# Altium project HLib-MBoard1.PrjPCB
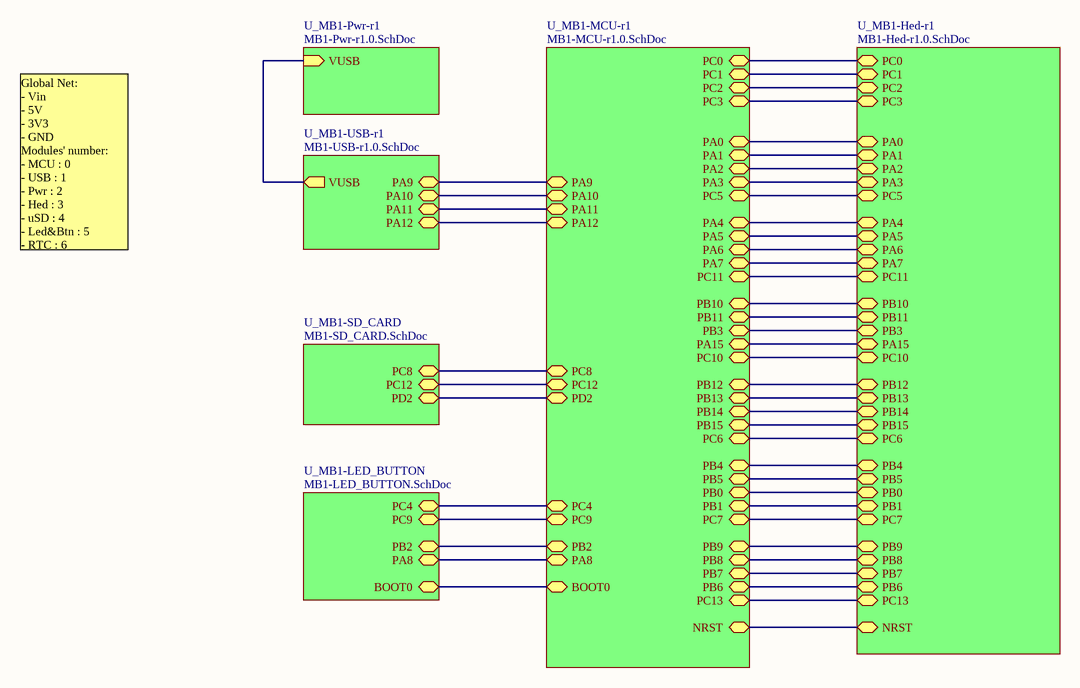
[diagram p0: MBoard1-R1.0.SchDoc]
7 sheets, 130 parts. Net scope: hierarchical (ports join the sheet entries above them; power ports are global).
Board file: HLib-MBoard1.PcbDoc
Sheets:
  MBoard1-R1.0.SchDoc
    U_MB1-Pwr-r1 = MB1-Pwr-r1.0.SchDoc
    U_MB1-USB-r1 = MB1-USB-r1.0.SchDoc
    U_MB1-Hed-r1 = MB1-Hed-r1.0.SchDoc
    U_MB1-MCU-r1 = MB1-MCU-r1.0.SchDoc
    U_MB1-SD_CARD = MB1-SD_CARD.SchDoc
    U_MB1-LED_BUTTON = MB1-LED_BUTTON.SchDoc

## Sheet MBoard1-R1.0.SchDoc: HLib - MBoard1
size A; DrawnBy: MBoard team; DocumentNumber: 1; Revision: 1.1; SheetNumber: 1; SheetTotal: 7; ProjectName: HLib

### Sub-sheets
U_MB1-Hed-r1 = MB1-Hed-r1.0.SchDoc: PC0 (bidir), PC1 (bidir), PC2 (bidir), PC3 (bidir), PA0 (bidir), PA1 (bidir), PA2 (bidir), PA3 (bidir), PA4 (bidir), PA5 (bidir), PA6 (bidir), PA7 (bidir), PB10 (bidir), PB11 (bidir), PB3 (bidir), PA15 (bidir), PB12 (bidir), PB13 (bidir), PB14 (bidir), PB15 (bidir), PB4 (bidir), PB5 (bidir), PB0 (bidir), PB1 (bidir), PB9 (bidir), PB8 (bidir), PB6 (bidir), PB7 (bidir), NRST (bidir), PC6 (bidir), PC10 (bidir), PC5, PC11, PC7 (bidir), PC13 (bidir)
U_MB1-LED_BUTTON = MB1-LED_BUTTON.SchDoc: PC4 (bidir), PB2 (bidir), PA8 (bidir), BOOT0 (bidir), PC9 (bidir)
U_MB1-MCU-r1 = MB1-MCU-r1.0.SchDoc: PA0 (bidir), PA1 (bidir), PA2 (bidir), PA3 (bidir), PA4 (bidir), PA5 (bidir), PA6 (bidir), PA7 (bidir), PA8 (bidir), PA9 (bidir), PA10 (bidir), PA11 (bidir), PA12 (bidir), PA15 (bidir), PD2 (bidir), BOOT0 (bidir), NRST (bidir), PB0 (bidir), PB1 (bidir), PB2 (bidir), PB3 (bidir), PB4 (bidir), PB5 (bidir), PB6 (bidir), PB7 (bidir), PB8 (bidir), PB9 (bidir), PB10 (bidir), PB11 (bidir), PB12 (bidir), PB13 (bidir), PB14 (bidir), PB15 (bidir), PC0 (bidir), PC1 (bidir), PC2 (bidir), PC3 (bidir), PC4 (bidir), PC5 (bidir), PC6 (bidir), PC7 (bidir), PC8 (bidir), PC9 (bidir), PC10 (bidir), PC11 (bidir), PC12 (bidir), PC13 (bidir)
U_MB1-Pwr-r1 = MB1-Pwr-r1.0.SchDoc: VUSB (in)
U_MB1-SD_CARD = MB1-SD_CARD.SchDoc: PD2 (bidir), PC12 (bidir), PC8 (bidir)
U_MB1-USB-r1 = MB1-USB-r1.0.SchDoc: PA9 (bidir), PA10 (bidir), VUSB (out), PA11 (bidir), PA12 (bidir)

### Nets
Ain0: sheet U_MB1-Hed-r1/PC0, sheet U_MB1-MCU-r1/PC0
Ain1: sheet U_MB1-Hed-r1/PC1, sheet U_MB1-MCU-r1/PC1
Ain2: sheet U_MB1-Hed-r1/PC2, sheet U_MB1-MCU-r1/PC2
Ain3: sheet U_MB1-Hed-r1/PC3, sheet U_MB1-MCU-r1/PC3
BOOT0: sheet U_MB1-MCU-r1/BOOT0, sheet U_MB1-LED_BUTTON/BOOT0
BOOT1: sheet U_MB1-MCU-r1/PB2, sheet U_MB1-LED_BUTTON/PB2
CAN_Rx/I2C1_SCK/TM4_CH3: sheet U_MB1-Hed-r1/PB8, sheet U_MB1-MCU-r1/PB8
CAN_Tx/I2C1_SDA/TM4_CH4: sheet U_MB1-Hed-r1/PB9, sheet U_MB1-MCU-r1/PB9
ClockOut: sheet U_MB1-MCU-r1/PA8, sheet U_MB1-LED_BUTTON/PA8
D11_N: sheet U_MB1-USB-r1/PA11, sheet U_MB1-MCU-r1/PA11
D11_P: sheet U_MB1-USB-r1/PA12, sheet U_MB1-MCU-r1/PA12
DATALINE_BIT0: sheet U_MB1-MCU-r1/PC8, sheet U_MB1-SD_CARD/PC8
DebugGreen: sheet U_MB1-MCU-r1/PC4, sheet U_MB1-LED_BUTTON/PC4
DebugRed: sheet U_MB1-MCU-r1/PC9, sheet U_MB1-LED_BUTTON/PC9
I2S_MCLK: sheet U_MB1-Hed-r1/PC6, sheet U_MB1-MCU-r1/PC6
IO1 (ADC): sheet U_MB1-Hed-r1/PC5, sheet U_MB1-MCU-r1/PC5
IO1 (Anti-Tamper): sheet U_MB1-Hed-r1/PC13, sheet U_MB1-MCU-r1/PC13
IO1 (P3): sheet U_MB1-Hed-r1/PC11, sheet U_MB1-MCU-r1/PC11
IO1 (P6): sheet U_MB1-Hed-r1/PC7, sheet U_MB1-MCU-r1/PC7
IO1/TM2_CH2: sheet U_MB1-Hed-r1/PB3, sheet U_MB1-MCU-r1/PB3
IO2/TM2_CH1: sheet U_MB1-Hed-r1/PA15, sheet U_MB1-MCU-r1/PA15
IO3 (P5): sheet U_MB1-Hed-r1/PC10, sheet U_MB1-MCU-r1/PC10
NRST: sheet U_MB1-Hed-r1/NRST, sheet U_MB1-MCU-r1/NRST
RxD: sheet U_MB1-USB-r1/PA9, sheet U_MB1-MCU-r1/PA9
SPI1_MISO: sheet U_MB1-Hed-r1/PA6, sheet U_MB1-MCU-r1/PA6
SPI1_MOSI: sheet U_MB1-Hed-r1/PA7, sheet U_MB1-MCU-r1/PA7
SPI1_NSS/DAC_OUT1: sheet U_MB1-Hed-r1/PA4, sheet U_MB1-MCU-r1/PA4
SPI1_SCK/DAC_OUT2: sheet U_MB1-Hed-r1/PA5, sheet U_MB1-MCU-r1/PA5
SPI2_MISO: sheet U_MB1-Hed-r1/PB14, sheet U_MB1-MCU-r1/PB14
SPI2_MOSI/I2S2_SD: sheet U_MB1-Hed-r1/PB15, sheet U_MB1-MCU-r1/PB15
SPI2_NSS/I2S2_WS: sheet U_MB1-Hed-r1/PB12, sheet U_MB1-MCU-r1/PB12
SPI2_SCK/I2S2_CK: sheet U_MB1-Hed-r1/PB13, sheet U_MB1-MCU-r1/PB13
TM3_CH1: sheet U_MB1-Hed-r1/PB4, sheet U_MB1-MCU-r1/PB4
TM3_CH2: sheet U_MB1-Hed-r1/PB5, sheet U_MB1-MCU-r1/PB5
TM3_CH3: sheet U_MB1-Hed-r1/PB0, sheet U_MB1-MCU-r1/PB0
TM3_CH4: sheet U_MB1-Hed-r1/PB1, sheet U_MB1-MCU-r1/PB1
TM4_CH1: sheet U_MB1-Hed-r1/PB6, sheet U_MB1-MCU-r1/PB6
TM4_CH2: sheet U_MB1-Hed-r1/PB7, sheet U_MB1-MCU-r1/PB7
TxD: sheet U_MB1-USB-r1/PA10, sheet U_MB1-MCU-r1/PA10
US2_CTS/TM5_CH4: sheet U_MB1-Hed-r1/PA0, sheet U_MB1-MCU-r1/PA0
US2_RTS/TM5_CH3: sheet U_MB1-Hed-r1/PA1, sheet U_MB1-MCU-r1/PA1
US2_Rx/TM5_CH1: sheet U_MB1-Hed-r1/PA3, sheet U_MB1-MCU-r1/PA3
US2_Tx/TM5_CH2: sheet U_MB1-Hed-r1/PA2, sheet U_MB1-MCU-r1/PA2
US3_Rx/I2C2_SDA/TM2_CH4: sheet U_MB1-Hed-r1/PB11, sheet U_MB1-MCU-r1/PB11
US3_Tx/I2C2_SCL/TM2_CH3: sheet U_MB1-Hed-r1/PB10, sheet U_MB1-MCU-r1/PB10
uSD_CLK: sheet U_MB1-MCU-r1/PC12, sheet U_MB1-SD_CARD/PC12
uSD_CMD: sheet U_MB1-MCU-r1/PD2, sheet U_MB1-SD_CARD/PD2
VUSB0: sheet U_MB1-Pwr-r1/VUSB, sheet U_MB1-USB-r1/VUSB

### Notes on the sheet
- Global Net:
  - Vin
  - 5V
  - 3V3
  - GND
  Modules' number:
  - MCU : 0
  - USB : 1
  - Pwr : 2
  - Hed : 3
  - uSD : 4
  - Led&Btn : 5
  - RTC : 6

## Sheet MB1-Pwr-r1.0.SchDoc: Power
size A; DrawnBy: MBoard team; DocumentNumber: 4; Revision: 1.1; SheetNumber: 4; SheetTotal: 7
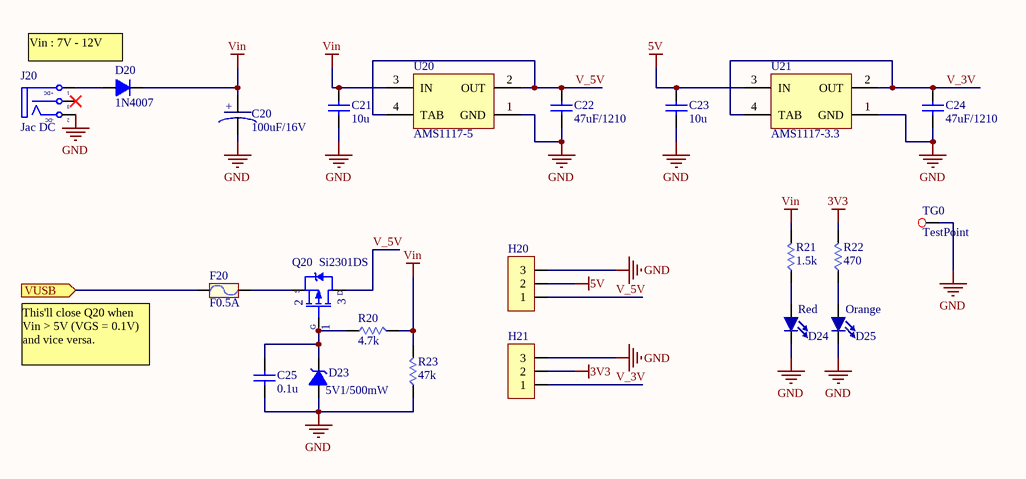
[diagram p1: MB1-Pwr-r1.0.SchDoc]

### Parts
C20  value 100uF/16V  [TantalumCaseD]  (hidden comment: CapT)
C21  value 10u  [SM_0805_LD]  (hidden comment: CAP Ceramic)
C22  value 47uF/1210  [SM-1210]  (hidden comment: CAP Ceramic)
C23  value 10u  [SM_0805_LD]  (hidden comment: CAP Ceramic)
C24  value 47uF/1210  [SM-1210]  (hidden comment: CAP Ceramic)
C25  value 0.1u  [SM_0805_LD]  (hidden comment: CAP Ceramic)
D20  1N4007  [DO-214AC]
D23  5V1/500mW  [SOD-123]
D24  Red  [SM_0805_POL_LD]
D25  Orange  [SM_0805_POL_LD]
F20  F0.5A  [SMD-1812]
H20  Hed3  [Hed3]  (value not drawn)
H21  Hed3  [Hed3]  (value not drawn)
J20  Jac DC  [DCJack]
Q20  Si2301DS  [SOT23]
R20  value 4.7k  [SM_0805_LD]
R21  value 1.5k  [SM_0805_LD]
R22  value 470  [SM_0805_LD]
R23  value 47k  [SM_0805_LD]
TG0  TestPoint  [TestPoint]
U20  AMS1117-5  [MP04A_N]
U21  AMS1117-3.3  [MP04A_N]

### Ports
VUSB (in)

### Nets
3V3: H21.2 R22.2
5V: C23.2 H20.2 U21.3(IN)
GND: C20.2(-) C21.1 C22.1 C23.1 C24.1 C25.1 D23.1(A) D24.2(K) D25.2(K) H20.3 H21.3 J20.2(TN) R23.1 TG0.1 U20.1(GND) U21.1(GND)
Vin: C20.1(+) C21.2 D20.2(K) R20.2 R21.2 R23.2 U20.3(IN)
V_3V: C24.2 H21.1 U21.2(OUT) U21.4(TAB)
V_5V: C22.2 H20.1 Q20.3(D) U20.2(OUT) U20.4(TAB)
VUSB0: F20.1 ; port VUSB
NetC25_2: C25.2 D23.2(K) Q20.1(G) R20.1
NetD20_1: D20.1(A) J20.1(T)
NetD24_1: D24.1(A) R21.1
NetD25_1: D25.1(A) R22.1
NetF20_2: F20.2 Q20.2(S)

Not connected (* = marked no-connect by the designer): J20 3(S)*

### Notes on the sheet
- Vin : 7V - 12V
- This'll close Q20 when Vin > 5V (VGS = 0.1V) and vice versa.
- (in symbol DCIN) +DC; -DC

### Library data of the parts
C20 = CapA
C21-C25 = CAP Ceramic: Non-polarity ceramic capacitor; Published: 8-Jun-2000; LatestRevisionDate: 17-Jul-2002; LatestRevisionNote: Re-released for DXP Platform.; PackageReference: RAD-0.3; Publisher: Altium Limited; PackageDescription: Radial Cap, Thru-Hole; 2 Leads; 0.3 in Pin Spacing
D20 = D1A: Diode 1A; Value: 1N4007
D23 = DZ: Diode Zenner; Value: 5V1/500mW
D24 D25 = LED: Published: 8-Jun-2000; LatestRevisionDate: 08-Jul-2005; LatestRevisionNote: Mech Layer 1 removed.; PackageReference: LED-1; Publisher: Altium Limited; PackageDescription: LED; 2 Leads
F20 = Fuse: Designed by: VanDungEvn; Value: Fuse
J20 = DCIN: Jac DC input; Value: Jac DC
Q20 = P-MOSFET: P-Channel 1.25-W, 2.5-V MOSFET
R20-R23 = R: Resistor; Published: 8-Jun-2000; LatestRevisionDate: 29-May-2009; LatestRevisionNote: IPC-7351 Footprint Added.; PackageReference: J1-0603; Publisher: Altium Limited; PackageDescription: Chip Resistor
U20 U21 = LM1117IMP-3.3: 800mA Low-Dropout Linear Regulator, 4-pin SOT-223; Manufacturer: National Semiconductor; PackageTopMarking: XYTT*N05B; PowerWise: N; CompType: LDO IC; Published: 4-Dec-2008; DatasheetVersion: Apr-2006; PackageVersion: revB, Apr-2003; PackageReference: MP04A; Publisher: Altium Limited; PackageDescription: Molded SOT-223, 6.50 x 3.56 x 1.6mm Body, 4 Lead, 2.3mm Pitch; Supplier 1: Farnell; Supplier Part Number 1: 7614123; PartNumber: LM1117IMP-3.3; RoHS: N; PinCount: 4; Code_JEDEC: TO-261-AA; Code_IPC: SOT223-4; ComponentLink1Description: LM1117 Datasheet; ComponentLink1URL: http://www.national.com/ds/LM/LM1117.pdf; ComponentLink2Description: LM1117 Web Page; ComponentLink2URL: http://www.national.com/pf/LM/LM1117.html; ComponentLink3Description: MP04A Package Page; ComponentLink3URL: http://www.national.com/packaging/folders/mp04a.html

## Sheet MB1-USB-r1.0.SchDoc: USB2Com & USB Native
size A; DrawnBy: MBoard team; DocumentNumber: 3; Revision: 1.1; SheetNumber: 3; SheetTotal: 7
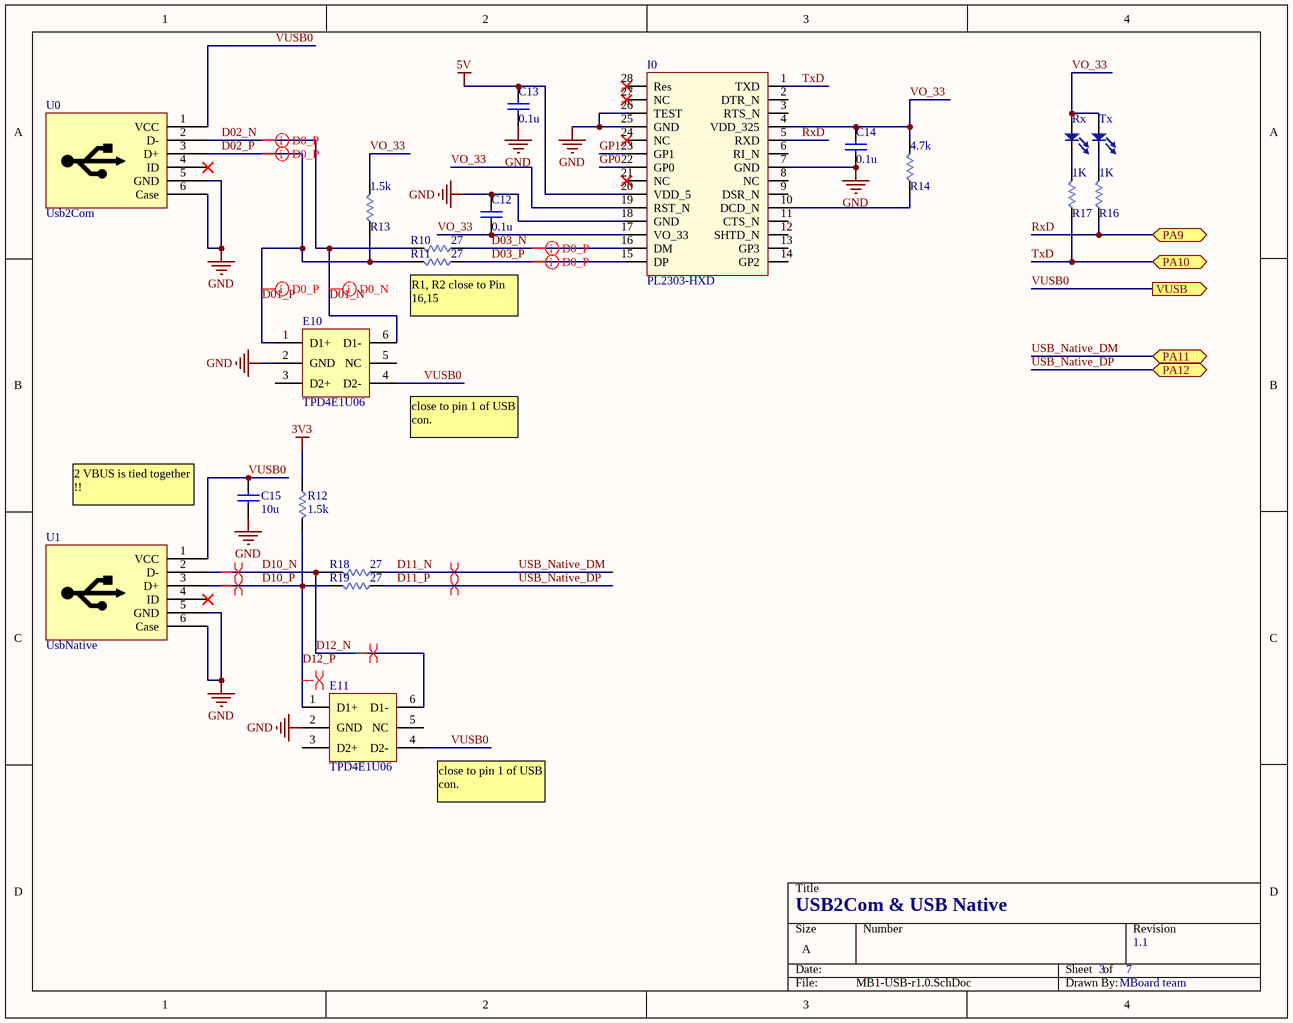
[diagram p2: MB1-USB-r1.0.SchDoc]

### Parts
C12  value 0.1u  [SM_0805_LD]  (hidden comment: CAP Ceramic)
C13  value 0.1u  [SM_0805_LD]  (hidden comment: CAP Ceramic)
C14  value 0.1u  [SM_0805_LD]  (hidden comment: CAP Ceramic)
C15  value 10u  [SM_0805_LD]  (hidden comment: CAP Ceramic)
E10  TPD4E1U06  [SC70-6]
E11  TPD4E1U06  [SC70-6]
I0  PL2303-HXD  [SSOP-28]
R10  value 27  [SM_0805_LD]
R11  value 27  [SM_0805_LD]
R12  value 1.5k  [SM_0805_LD]
R13  value 1.5k  [SM_0805_LD]
R14  value 4.7k  [SM_0805_LD]
R16  value 1K  [SM_0805_LD]
R17  value 1K  [SM_0805_LD]
R18  value 27  [SM_0805_LD]
R19  value 27  [SM_0805_LD]
Rx  Blue  [SM_0805_POL_LD]  (value not drawn)
Tx  Green  [SM_0805_POL_LD]  (value not drawn)
U0  Usb2Com  [USB-mini-B]
U1  UsbNative  [USB-mini-B]

### Ports
PA9 (bidir), PA10 (bidir), PA11 (bidir), PA12 (bidir), VUSB (out)

### Nets
3V3: R12.1
5V: C13.2 I0.20(VDD_5)
GND: C12.2 C13.1 C14.1 C15.1 E10.2(GND) E11.2(GND) I0.7(GND) I0.18(GND) I0.25(GND) I0.26(TEST) U0.5(GND) U0.6(Case) U1.5(GND) U1.6(Case)
D01_N: E10.6(D1-) R10.2 U0.2(D-)  [also labelled D02_N]
D01_P: E10.1(D1+) R11.2 R13.1 U0.3(D+)  [also labelled D02_P]
D03_N: I0.16(DM) R10.1
D03_P: I0.15(DP) R11.1
D10_N: E11.6(D1-) R18.2 U1.2(D-)  [also labelled D12_N]
D10_P: E11.1(D1+) R12.2 R19.2 U1.3(D+)  [also labelled D12_P]
D11_N: R18.1 ; port PA11  [also labelled USB_Native_DM]
D11_P: R19.1 ; port PA12  [also labelled USB_Native_DP]
GP0: I0.22(GP0)
GP1: I0.23(GP1)
RxD: I0.5(RXD) R16.1 ; port PA9
TxD: I0.1(TXD) R17.1 ; port PA10
VO_33: C12.1 C14.2 I0.4(VDD_325) I0.17(VO_33) I0.19(RST_N) R13.2 R14.2 Rx.1(A) Tx.1(A)
VUSB0: C15.2 E10.4(D2-) E11.4(D2-) U0.1(VCC) U1.1(VCC) ; port VUSB
NetI0_10: I0.10(DCD_N) R14.1
NetR16_2: R16.2 Tx.2(K)
NetR17_2: R17.2 Rx.2(K)

Not connected (* = marked no-connect by the designer): E10 3(D2+) 5(NC); E11 3(D2+) 5(NC); I0 2(DTR_N) 3(RTS_N) 6(RI_N) 8(NC) 9(DSR_N) 11(CTS_N) 12(SHTD_N) 13(GP3) 14(GP2) 21(NC)* 24(NC)* 27(NC)* 28(Res)*; U0 4(ID)*; U1 4(ID)*

### Layout directives
differential pair: D01_N, D01_P, D03_N, D03_P, D10_N, D10_P, D11_N, D11_P

### Notes on the sheet
- (near R11) R1, R2 close to Pin 16,15
- (near E10) close to pin 1 of USB con.
- 2 VBUS is tied together !!
- (near E11) close to pin 1 of USB con.

### Library data of the parts
C12-C15 = CAP Ceramic: Non-polarity ceramic capacitor; Published: 8-Jun-2000; LatestRevisionDate: 17-Jul-2002; LatestRevisionNote: Re-released for DXP Platform.; PackageReference: RAD-0.3; Publisher: Altium Limited; PackageDescription: Radial Cap, Thru-Hole; 2 Leads; 0.3 in Pin Spacing
R10-R14 R16-R19 = R: Resistor; Published: 8-Jun-2000; LatestRevisionDate: 29-May-2009; LatestRevisionNote: IPC-7351 Footprint Added.; PackageReference: J1-0603; Publisher: Altium Limited; PackageDescription: Chip Resistor
Rx Tx = LED: Published: 8-Jun-2000; LatestRevisionDate: 08-Jul-2005; LatestRevisionNote: Mech Layer 1 removed.; PackageReference: LED-1; Publisher: Altium Limited; PackageDescription: LED; 2 Leads
U0 U1 = USB-Mini-B

## Sheet MB1-Hed-r1.0.SchDoc: Headers
size A; DrawnBy: MBoard Team; DocumentNumber: 5; Revision: 1.1; SheetNumber: 5; SheetTotal: 7
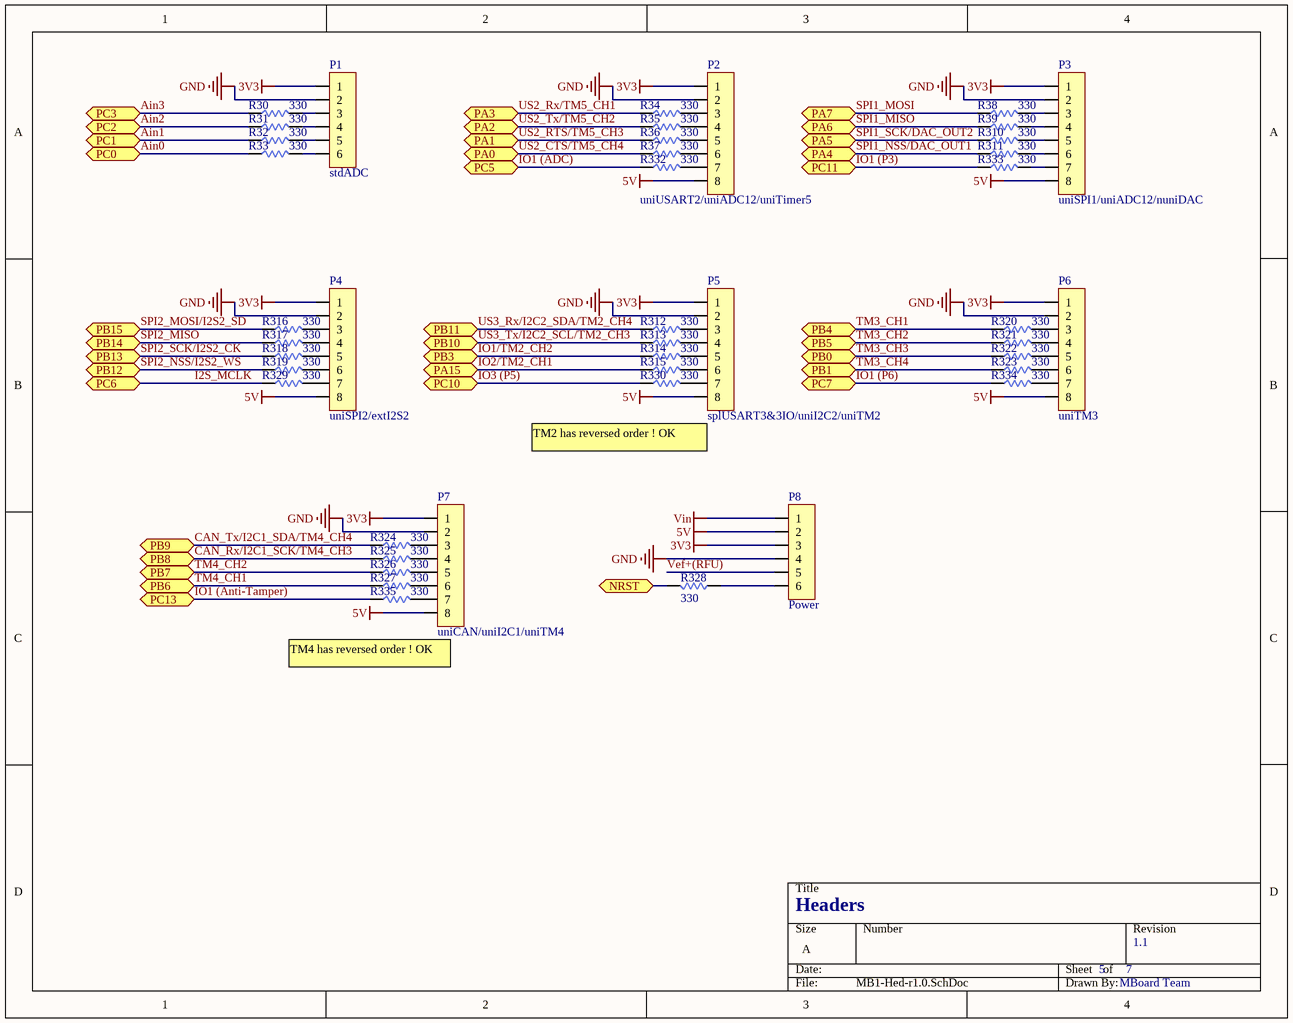
[diagram p3: MB1-Hed-r1.0.SchDoc]

### Parts
P1  stdADC  [Hed6]
P2  uniUSART2/uniADC12/uniTimer5  [Hed8]
P3  uniSPI1/uniADC12/nuniDAC  [Hed8]
P4  uniSPI2/extI2S2  [Hed8]
P5  splUSART3&3IO/uniI2C2/uniTM2  [Hed8]
P6  uniTM3  [Hed8]
P7  uniCAN/uniI2C1/uniTM4  [Hed8]
P8  Power  [Hed6]
R30  value 330  [SM_0805_LD]  (hidden comment: R)
R31  value 330  [SM_0805_LD]  (hidden comment: R)
R32  value 330  [SM_0805_LD]  (hidden comment: R)
R33  value 330  [SM_0805_LD]  (hidden comment: R)
R34  value 330  [SM_0805_LD]  (hidden comment: R)
R35  value 330  [SM_0805_LD]  (hidden comment: R)
R36  value 330  [SM_0805_LD]  (hidden comment: R)
R37  value 330  [SM_0805_LD]  (hidden comment: R)
R38  value 330  [SM_0805_LD]  (hidden comment: R)
R39  value 330  [SM_0805_LD]  (hidden comment: R)
R310  value 330  [SM_0805_LD]  (hidden comment: R)
R311  value 330  [SM_0805_LD]  (hidden comment: R)
R312  value 330  [SM_0805_LD]  (hidden comment: R)
R313  value 330  [SM_0805_LD]  (hidden comment: R)
R314  value 330  [SM_0805_LD]  (hidden comment: R)
R315  value 330  [SM_0805_LD]  (hidden comment: R)
R316  value 330  [SM_0805_LD]  (hidden comment: R)
R317  value 330  [SM_0805_LD]  (hidden comment: R)
R318  value 330  [SM_0805_LD]  (hidden comment: R)
R319  value 330  [SM_0805_LD]  (hidden comment: R)
R320  value 330  [SM_0805_LD]  (hidden comment: R)
R321  value 330  [SM_0805_LD]  (hidden comment: R)
R322  value 330  [SM_0805_LD]  (hidden comment: R)
R323  value 330  [SM_0805_LD]  (hidden comment: R)
R324  value 330  [SM_0805_LD]  (hidden comment: R)
R325  value 330  [SM_0805_LD]  (hidden comment: R)
R326  value 330  [SM_0805_LD]  (hidden comment: R)
R327  value 330  [SM_0805_LD]  (hidden comment: R)
R328  value 330  [SM_0805_LD]  (hidden comment: R)
R329  value 330  [SM_0805_LD]  (hidden comment: R)
R330  value 330  [SM_0805_LD]  (hidden comment: R)
R332  value 330  [SM_0805_LD]  (hidden comment: R)
R333  value 330  [SM_0805_LD]  (hidden comment: R)
R334  value 330  [SM_0805_LD]  (hidden comment: R)
R335  value 330  [SM_0805_LD]  (hidden comment: R)

### Ports
NRST (bidir), PA0 (bidir), PA1 (bidir), PA2 (bidir), PA3 (bidir), PA4 (bidir), PA5 (bidir), PA6 (bidir), PA7 (bidir), PA15 (bidir), PB0 (bidir), PB1 (bidir), PB3 (bidir), PB4 (bidir), PB5 (bidir), PB6 (bidir), PB7 (bidir), PB8 (bidir), PB9 (bidir), PB10 (bidir), PB11 (bidir), PB12 (bidir), PB13 (bidir), PB14 (bidir), PB15 (bidir), PC0 (bidir), PC1 (bidir), PC2 (bidir), PC3 (bidir), PC5 (bidir), PC6 (bidir), PC7 (bidir), PC10 (bidir), PC11 (bidir), PC13 (bidir)

### Nets
3V3: P1.1 P2.1 P3.1 P4.1 P5.1 P6.1 P7.1 P8.3
5V: P2.8 P3.8 P4.8 P5.8 P6.8 P7.8 P8.2
GND: P1.2 P2.2 P3.2 P4.2 P5.2 P6.2 P7.2 P8.4
Vin: P8.1
Ain0: R33.1 ; port PC0
Ain1: R32.1 ; port PC1
Ain2: R31.1 ; port PC2
Ain3: R30.1 ; port PC3
CAN_Rx/I2C1_SCK/TM4_CH3: R325.1 ; port PB8
CAN_Tx/I2C1_SDA/TM4_CH4: R324.1 ; port PB9
I2S_MCLK: R329.1 ; port PC6
IO1 (ADC): R332.1 ; port PC5
IO1 (Anti-Tamper): R335.1 ; port PC13
IO1 (P3): R333.1 ; port PC11
IO1 (P6): R334.1 ; port PC7
IO1/TM2_CH2: R314.1 ; port PB3
IO2/TM2_CH1: R315.1 ; port PA15
IO3 (P5): R330.1 ; port PC10
NRST: R328.1 ; port NRST
SPI1_MISO: R39.1 ; port PA6
SPI1_MOSI: R38.1 ; port PA7
SPI1_NSS/DAC_OUT1: R311.1 ; port PA4
SPI1_SCK/DAC_OUT2: R310.1 ; port PA5
SPI2_MISO: R317.1 ; port PB14
SPI2_MOSI/I2S2_SD: R316.1 ; port PB15
SPI2_NSS/I2S2_WS: R319.1 ; port PB12
SPI2_SCK/I2S2_CK: R318.1 ; port PB13
TM3_CH1: R320.1 ; port PB4
TM3_CH2: R321.1 ; port PB5
TM3_CH3: R322.1 ; port PB0
TM3_CH4: R323.1 ; port PB1
TM4_CH1: R327.1 ; port PB6
TM4_CH2: R326.1 ; port PB7
US2_CTS/TM5_CH4: R37.1 ; port PA0
US2_RTS/TM5_CH3: R36.1 ; port PA1
US2_Rx/TM5_CH1: R34.1 ; port PA3
US2_Tx/TM5_CH2: R35.1 ; port PA2
US3_Rx/I2C2_SDA/TM2_CH4: R312.1 ; port PB11
US3_Tx/I2C2_SCL/TM2_CH3: R313.1 ; port PB10
Vef+(RFU): P8.5
NetP1_3: P1.3 R30.2
NetP1_4: P1.4 R31.2
NetP1_5: P1.5 R32.2
NetP1_6: P1.6 R33.2
NetP2_3: P2.3 R34.2
NetP2_4: P2.4 R35.2
NetP2_5: P2.5 R36.2
NetP2_6: P2.6 R37.2
NetP2_7: P2.7 R332.2
NetP3_3: P3.3 R38.2
NetP3_4: P3.4 R39.2
NetP3_5: P3.5 R310.2
NetP3_6: P3.6 R311.2
NetP3_7: P3.7 R333.2
NetP4_3: P4.3 R316.2
NetP4_4: P4.4 R317.2
NetP4_5: P4.5 R318.2
NetP4_6: P4.6 R319.2
NetP4_7: P4.7 R329.2
NetP5_3: P5.3 R312.2
NetP5_4: P5.4 R313.2
NetP5_5: P5.5 R314.2
NetP5_6: P5.6 R315.2
NetP5_7: P5.7 R330.2
NetP6_3: P6.3 R320.2
NetP6_4: P6.4 R321.2
NetP6_5: P6.5 R322.2
NetP6_6: P6.6 R323.2
NetP6_7: P6.7 R334.2
NetP7_3: P7.3 R324.2
NetP7_4: P7.4 R325.2
NetP7_5: P7.5 R326.2
NetP7_6: P7.6 R327.2
NetP7_7: P7.7 R335.2
NetP8_6: P8.6 R328.2

### Notes on the sheet
- TM2 has reversed order ! OK
- TM4 has reversed order ! OK

### Library data of the parts
P1 P8 = Hed6
P2-P7 = Hed8
R30-R39 R310-R330 R332-R335 = R: Resistor; Published: 8-Jun-2000; LatestRevisionDate: 29-May-2009; LatestRevisionNote: IPC-7351 Footprint Added.; PackageReference: J1-0603; Publisher: Altium Limited; PackageDescription: Chip Resistor

## Sheet MB1-MCU-r1.0.SchDoc: STM32F103
size A; DrawnBy: MBoard team; DocumentNumber: 2; Revision: 1.1; SheetNumber: 2; SheetTotal: 7
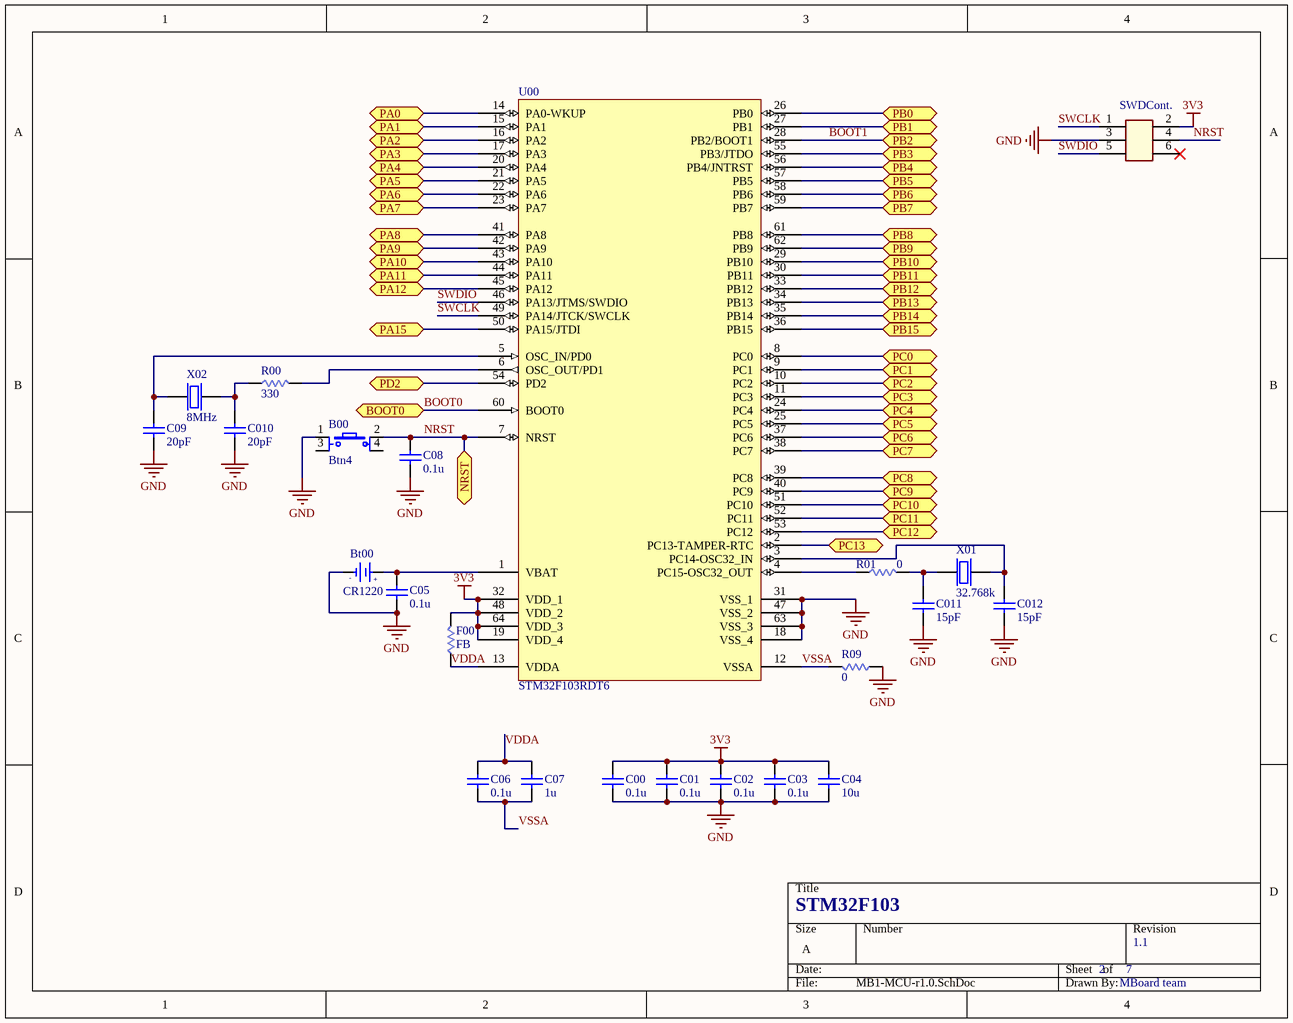
[diagram p4: MB1-MCU-r1.0.SchDoc]

### Parts
B00  Btn4  [Horizon_SW_4pin_rectangular]
Bt00  value CR1220  [PIN3VSOCKET-SMD]  (hidden comment: PIN 3V)
C00  value 0.1u  [SM_0805_LD]  (hidden comment: CAP Ceramic)
C01  value 0.1u  [SM_0805_LD]  (hidden comment: CAP Ceramic)
C02  value 0.1u  [SM_0805_LD]  (hidden comment: CAP Ceramic)
C03  value 0.1u  [SM_0805_LD]  (hidden comment: CAP Ceramic)
C04  value 10u  [SM_0805_LD]  (hidden comment: CAP Ceramic)
C05  value 0.1u  [SM_0805_LD]  (hidden comment: CAP Ceramic)
C06  value 0.1u  [SM_0805_LD]  (hidden comment: CAP Ceramic)
C07  value 1u  [SM_0805_LD]  (hidden comment: CAP Ceramic)
C08  value 0.1u  [SM_0805_LD]  (hidden comment: CAP Ceramic)
C09  value 20pF  [SM_0805_LD]  (hidden comment: CAP Ceramic)
C010  value 20pF  [SM_0805_LD]  (hidden comment: CAP Ceramic)
C011  value 15pF  [SM_0805_LD]  (hidden comment: CAP Ceramic)
C012  value 15pF  [SM_0805_LD]  (hidden comment: CAP Ceramic)
F00  value FB  [SM_0805_LD]  (hidden comment: Ferrite bead)
R00  value 330  [SM_0805_LD]
R01  value 0  [SM_0805_LD]
R09  value 0  [SM_0805_LD]
SWDCont.  SWD  [Hed3x2-RA]  (value not drawn)
U00  STM32F103RDT6  [LQFP64_L]
X01  value 32.768k  [XT32-LOB]  (hidden comment: Crystal 32.768 k)
X02  value 8MHz  [HC49/US-SMD]  (hidden comment: Crystal 2 pin.)

### Ports
BOOT0 (bidir), NRST (bidir), PA0 (bidir), PA1 (bidir), PA2 (bidir), PA3 (bidir), PA4 (bidir), PA5 (bidir), PA6 (bidir), PA7 (bidir), PA8 (bidir), PA9 (bidir), PA10 (bidir), PA11 (bidir), PA12 (bidir), PA15 (bidir), PB0 (bidir), PB1 (bidir), PB2 (bidir), PB3 (bidir), PB4 (bidir), PB5 (bidir), PB6 (bidir), PB7 (bidir), PB8 (bidir), PB9 (bidir), PB10 (bidir), PB11 (bidir), PB12 (bidir), PB13 (bidir), PB14 (bidir), PB15 (bidir), PC0 (bidir), PC1 (bidir), PC2 (bidir), PC3 (bidir), PC4 (bidir), PC5 (bidir), PC6 (bidir), PC7 (bidir), PC8 (bidir), PC9 (bidir), PC10 (bidir), PC11 (bidir), PC12 (bidir), PC13 (bidir), PD2 (bidir)

### Nets
3V3: C00.2 C01.2 C02.2 C03.2 C04.2 F00.2 SWDCont..2 U00.19(VDD_4) U00.32(VDD_1) U00.48(VDD_2) U00.64(VDD_3)
GND: B00.1(Tab) Bt00.2(GND) C00.1 C01.1 C02.1 C03.1 C04.1 C05.1 C08.1 C09.1 C010.1 C011.1 C012.1 R09.1 SWDCont..3 U00.18(VSS_4) U00.31(VSS_1) U00.47(VSS_2) U00.63(VSS_3)
Ain0: U00.8(PC0) ; port PC0
Ain1: U00.9(PC1) ; port PC1
Ain2: U00.10(PC2) ; port PC2
Ain3: U00.11(PC3) ; port PC3
BOOT0: U00.60(BOOT0) ; port BOOT0
BOOT1: U00.28(PB2/BOOT1) ; port PB2
CAN_Rx/I2C1_SCK/TM4_CH3: U00.61(PB8) ; port PB8
CAN_Tx/I2C1_SDA/TM4_CH4: U00.62(PB9) ; port PB9
ClockOut: U00.41(PA8) ; port PA8
D11_N: U00.44(PA11) ; port PA11
D11_P: U00.45(PA12) ; port PA12
DATALINE_BIT0: U00.39(PC8) ; port PC8
DebugGreen: U00.24(PC4) ; port PC4
DebugRed: U00.40(PC9) ; port PC9
I2S_MCLK: U00.37(PC6) ; port PC6
IO1 (ADC): U00.25(PC5) ; port PC5
IO1 (Anti-Tamper): U00.2(PC13-TAMPER-RTC) ; port PC13
IO1 (P3): U00.52(PC11) ; port PC11
IO1 (P6): U00.38(PC7) ; port PC7
IO1/TM2_CH2: U00.55(PB3/JTDO) ; port PB3
IO2/TM2_CH1: U00.50(PA15/JTDI) ; port PA15
IO3 (P5): U00.51(PC10) ; port PC10
NRST: B00.2(Tab) C08.2 SWDCont..4 U00.7(NRST) ; port NRST
RxD: U00.42(PA9) ; port PA9
SPI1_MISO: U00.22(PA6) ; port PA6
SPI1_MOSI: U00.23(PA7) ; port PA7
SPI1_NSS/DAC_OUT1: U00.20(PA4) ; port PA4
SPI1_SCK/DAC_OUT2: U00.21(PA5) ; port PA5
SPI2_MISO: U00.35(PB14) ; port PB14
SPI2_MOSI/I2S2_SD: U00.36(PB15) ; port PB15
SPI2_NSS/I2S2_WS: U00.33(PB12) ; port PB12
SPI2_SCK/I2S2_CK: U00.34(PB13) ; port PB13
SWCLK: SWDCont..1 U00.49(PA14/JTCK/SWCLK)
SWDIO: SWDCont..5 U00.46(PA13/JTMS/SWDIO)
TM3_CH1: U00.56(PB4/JNTRST) ; port PB4
TM3_CH2: U00.57(PB5) ; port PB5
TM3_CH3: U00.26(PB0) ; port PB0
TM3_CH4: U00.27(PB1) ; port PB1
TM4_CH1: U00.58(PB6) ; port PB6
TM4_CH2: U00.59(PB7) ; port PB7
TxD: U00.43(PA10) ; port PA10
US2_CTS/TM5_CH4: U00.14(PA0-WKUP) ; port PA0
US2_RTS/TM5_CH3: U00.15(PA1) ; port PA1
US2_Rx/TM5_CH1: U00.17(PA3) ; port PA3
US2_Tx/TM5_CH2: U00.16(PA2) ; port PA2
US3_Rx/I2C2_SDA/TM2_CH4: U00.30(PB11) ; port PB11
US3_Tx/I2C2_SCL/TM2_CH3: U00.29(PB10) ; port PB10
uSD_CLK: U00.53(PC12) ; port PC12
uSD_CMD: U00.54(PD2) ; port PD2
VDDA: C06.2 C07.2 F00.1 U00.13(VDDA)
VSSA: C06.1 C07.1 R09.2 U00.12(VSSA)
NetBt00_1: Bt00.1(+3V) C05.2 U00.1(VBAT)
NetC09_2: C09.2 U00.5(OSC_IN/PD0) X02.1(Xin)
NetC010_2: C010.2 R00.1 X02.2(Xout)
NetC011_2: C011.2 R01.2 X01.1(Xin)
NetC012_2: C012.2 U00.3(PC14-OSC32_IN) X01.2(Xout)
NetR00_2: R00.2 U00.6(OSC_OUT/PD1)
NetR01_1: R01.1 U00.4(PC15-OSC32_OUT)

Not connected (* = marked no-connect by the designer): B00 3(Tab) 4(Tab); SWDCont. 6*

### Notes on the sheet
- (in symbol PIN 3V) -; +

### Library data of the parts
Bt00 = PIN 3V: Battery 3VDC
C00 C01 C02 C03 C04 C05 C06 C07 C08 C09 C010 C011 C012 = CAP Ceramic: Non-polarity ceramic capacitor; Published: 8-Jun-2000; LatestRevisionDate: 17-Jul-2002; LatestRevisionNote: Re-released for DXP Platform.; PackageReference: RAD-0.3; Publisher: Altium Limited; PackageDescription: Radial Cap, Thru-Hole; 2 Leads; 0.3 in Pin Spacing
F00 R00 R01 R09 = R: Resistor; Published: 8-Jun-2000; LatestRevisionDate: 29-May-2009; LatestRevisionNote: IPC-7351 Footprint Added.; PackageReference: J1-0603; Publisher: Altium Limited; PackageDescription: Chip Resistor
SWDCont. = HD_3x2: Header, 3-pins/row, double row,
U00 = STM32F103RBT6: STM32 ARM-based 32-bit MCU with 128 Kbytes Flash, 64-pin LQFP, Industrial Temperature; Published: 30-May-2008; DatasheetVersion: rev6, Mar-2008; PackageVersion: Mar-2008; PackageReference: LQFP64; Publisher: Altium Limited; PackageDescription: 64-Pin Low-Profile Quad Flat Pack, 10 x 10 mm Body, 0.5 mm Pitch (LQFP64); ComponentLink1Description: Manufacturer Link; ComponentLink1URL: www.st.com/stm32; ComponentLink2Description: Datasheet; ComponentLink2URL: http://www.st.com/stonline/products/literature/ds/13587.pdf
X01 = XT32k
X02 = XT2

## Sheet MB1-SD_CARD.SchDoc: uSD card
size A; Author: Nguyen Van Hien; DrawnBy: MBoard team; DocumentNumber: 6; Revision: 1.1; SheetNumber: 6; SheetTotal: 7; DocumentName: SD_CARD
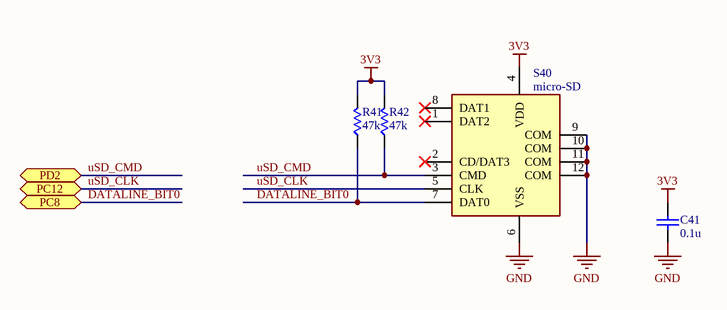
[diagram p5: MB1-SD_CARD.SchDoc]

### Parts
C41  value 0.1u  [SM_0805_LD]  (hidden comment: CAP_Ceramic)
R41  value 47k  [SM_0805_LD]
R42  value 47k  [SM_0805_LD]
S40  micro-SD  [micro-SD]

### Ports
PC8 (bidir), PC12 (bidir), PD2 (bidir)

### Nets
3V3: C41.2 R41.2 R42.2 S40.4(VDD)
GND: C41.1 S40.6(VSS) S40.9(COM) S40.10(COM) S40.11(COM) S40.12(COM)
DATALINE_BIT0: R41.1 S40.7(DAT0) ; port PC8
uSD_CLK: S40.5(CLK) ; port PC12
uSD_CMD: R42.1 S40.3(CMD) ; port PD2

Not connected (* = marked no-connect by the designer): S40 1(DAT2)* 2(CD/DAT3)* 8(DAT1)*

### Library data of the parts
C41 = C_Ceramic: Non-polarity ceramic capacitor; Published: 8-Jun-2000; LatestRevisionDate: 17-Jul-2002; LatestRevisionNote: Re-released for DXP Platform.; PackageReference: RAD-0.3; Publisher: Altium Limited; PackageDescription: Radial Cap, Thru-Hole; 2 Leads; 0.3 in Pin Spacing
R41 R42 = R: Resistor; Published: 8-Jun-2000; LatestRevisionDate: 29-May-2009; LatestRevisionNote: IPC-7351 Footprint Added.; PackageReference: J1-0603; Publisher: Altium Limited; PackageDescription: Chip Resistor

## Sheet MB1-LED_BUTTON.SchDoc: Leds & Buttons
size A; Author: Nguyen Van Hien; DrawnBy: MBoard team; DocumentNumber: 7; Revision: 1.1; SheetNumber: 7; SheetTotal: 7; DocumentName: LED_BUTTON
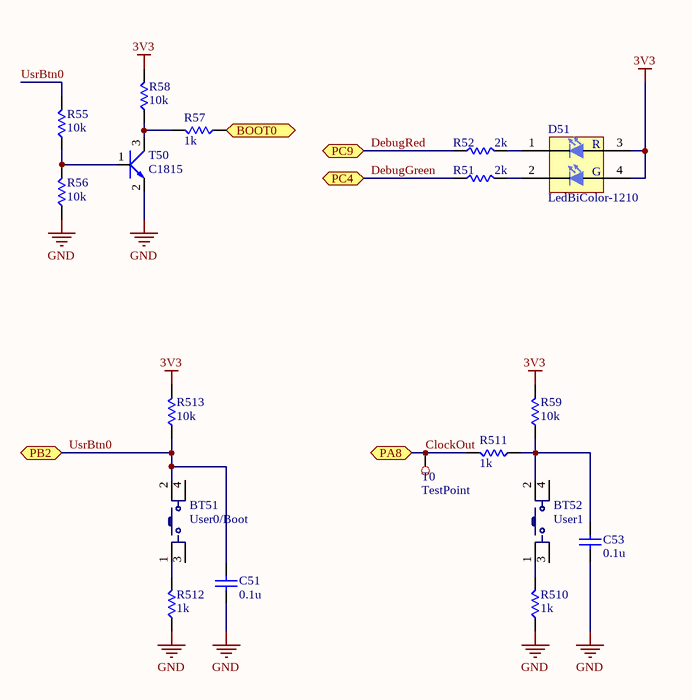
[diagram p6: MB1-LED_BUTTON.SchDoc]

### Parts
BT51  User0/Boot  [Horizon_SW_4pin_rectangular]
BT52  User1  [Horizon_SW_4pin_rectangular]
C51  value 0.1u  [SM_0805_LD]  (hidden comment: CAP_Ceramic)
C53  value 0.1u  [SM_0805_LD]  (hidden comment: CAP_Ceramic)
D51  LedBiColor-1210  [Led-BiColor]
R51  value 2k  [SM_0805_LD]
R52  value 2k  [SM_0805_LD]
R55  value 10k  [SM_0805_LD]
R56  value 10k  [SM_0805_LD]
R57  value 1k  [SM_0805_LD]
R58  value 10k  [SM_0805_LD]
R59  value 10k  [SM_0805_LD]
R510  value 1k  [SM_0805_LD]
R511  value 1k  [SM_0805_LD]
R512  value 1k  [SM_0805_LD]
R513  value 10k  [SM_0805_LD]
T0  TestPoint  [TestPoint]
T50  C1815  [SOT23]

### Ports
BOOT0 (bidir), PA8 (bidir), PB2 (bidir), PC4 (bidir), PC9 (bidir)

### Nets
3V3: D51.3(R+) D51.4(G+) R58.2 R59.2 R513.2
GND: C51.1 C53.1 R56.1 R510.1 R512.1 T50.2(E)
BOOT0: R57.1 ; port BOOT0
ClockOut: R511.2 T0.1 ; port PA8
DebugGreen: R51.1 ; port PC4
DebugRed: R52.1 ; port PC9
UsrBtn0: BT51.2 C51.2 R55.2 R513.1 ; port PB2  [project net BOOT1]
NetBT51_1: BT51.1 R512.2
NetBT52_1: BT52.1 R510.2
NetBT52_2: BT52.2 C53.2 R59.1 R511.1
NetD51_1: D51.1(R-) R52.2
NetD51_2: D51.2(G-) R51.2
NetR55_1: R55.1 R56.2 T50.1(B)
NetR57_2: R57.2 R58.1 T50.3(C)

Not connected (* = marked no-connect by the designer): BT51 3 4; BT52 3 4

### Notes on the sheet
- (in symbol LedBiColor-1210) R; G

### Library data of the parts
BT51 BT52 = Button: Tact switch
C51 C53 = C_Ceramic: Non-polarity ceramic capacitor; Published: 8-Jun-2000; LatestRevisionDate: 17-Jul-2002; LatestRevisionNote: Re-released for DXP Platform.; PackageReference: RAD-0.3; Publisher: Altium Limited; PackageDescription: Radial Cap, Thru-Hole; 2 Leads; 0.3 in Pin Spacing
R51 R52 R55-R59 R510-R513 = R: Resistor; Published: 8-Jun-2000; LatestRevisionDate: 29-May-2009; LatestRevisionNote: IPC-7351 Footprint Added.; PackageReference: J1-0603; Publisher: Altium Limited; PackageDescription: Chip Resistor

## Nets that join several sheets
3V3: MB1-Pwr-r1.0 (H21.2 R22.2), MB1-USB-r1.0 (R12.1), MB1-Hed-r1.0 (8 pins), MB1-MCU-r1.0 (11 pins), MB1-SD_CARD (C41.2 R41.2 R42.2 S40.4), MB1-LED_BUTTON (5 pins)
5V: MB1-Pwr-r1.0 (C23.2 H20.2 U21.3), MB1-USB-r1.0 (C13.2 I0.20), MB1-Hed-r1.0 (7 pins)
GND: MB1-Pwr-r1.0 (16 pins), MB1-USB-r1.0 (14 pins), MB1-Hed-r1.0 (8 pins), MB1-MCU-r1.0 (19 pins), MB1-SD_CARD (6 pins), MB1-LED_BUTTON (6 pins)
Vin: MB1-Pwr-r1.0 (7 pins), MB1-Hed-r1.0 (P8.1)
Ain0: MB1-Hed-r1.0 (R33.1), MB1-MCU-r1.0 (U00.8)
Ain1: MB1-Hed-r1.0 (R32.1), MB1-MCU-r1.0 (U00.9)
Ain2: MB1-Hed-r1.0 (R31.1), MB1-MCU-r1.0 (U00.10)
Ain3: MB1-Hed-r1.0 (R30.1), MB1-MCU-r1.0 (U00.11)
BOOT0: MB1-MCU-r1.0 (U00.60), MB1-LED_BUTTON (R57.1)
BOOT1: MB1-MCU-r1.0 (U00.28), MB1-LED_BUTTON (BT51.2 C51.2 R55.2 R513.1)
CAN_Rx/I2C1_SCK/TM4_CH3: MB1-Hed-r1.0 (R325.1), MB1-MCU-r1.0 (U00.61)
CAN_Tx/I2C1_SDA/TM4_CH4: MB1-Hed-r1.0 (R324.1), MB1-MCU-r1.0 (U00.62)
ClockOut: MB1-MCU-r1.0 (U00.41), MB1-LED_BUTTON (R511.2 T0.1)
D11_N: MB1-USB-r1.0 (R18.1), MB1-MCU-r1.0 (U00.44)
D11_P: MB1-USB-r1.0 (R19.1), MB1-MCU-r1.0 (U00.45)
DATALINE_BIT0: MB1-MCU-r1.0 (U00.39), MB1-SD_CARD (R41.1 S40.7)
DebugGreen: MB1-MCU-r1.0 (U00.24), MB1-LED_BUTTON (R51.1)
DebugRed: MB1-MCU-r1.0 (U00.40), MB1-LED_BUTTON (R52.1)
I2S_MCLK: MB1-Hed-r1.0 (R329.1), MB1-MCU-r1.0 (U00.37)
IO1 (ADC): MB1-Hed-r1.0 (R332.1), MB1-MCU-r1.0 (U00.25)
IO1 (Anti-Tamper): MB1-Hed-r1.0 (R335.1), MB1-MCU-r1.0 (U00.2)
IO1 (P3): MB1-Hed-r1.0 (R333.1), MB1-MCU-r1.0 (U00.52)
IO1 (P6): MB1-Hed-r1.0 (R334.1), MB1-MCU-r1.0 (U00.38)
IO1/TM2_CH2: MB1-Hed-r1.0 (R314.1), MB1-MCU-r1.0 (U00.55)
IO2/TM2_CH1: MB1-Hed-r1.0 (R315.1), MB1-MCU-r1.0 (U00.50)
IO3 (P5): MB1-Hed-r1.0 (R330.1), MB1-MCU-r1.0 (U00.51)
NRST: MB1-Hed-r1.0 (R328.1), MB1-MCU-r1.0 (B00.2 C08.2 SWDCont..4 U00.7)
RxD: MB1-USB-r1.0 (I0.5 R16.1), MB1-MCU-r1.0 (U00.42)
SPI1_MISO: MB1-Hed-r1.0 (R39.1), MB1-MCU-r1.0 (U00.22)
SPI1_MOSI: MB1-Hed-r1.0 (R38.1), MB1-MCU-r1.0 (U00.23)
SPI1_NSS/DAC_OUT1: MB1-Hed-r1.0 (R311.1), MB1-MCU-r1.0 (U00.20)
SPI1_SCK/DAC_OUT2: MB1-Hed-r1.0 (R310.1), MB1-MCU-r1.0 (U00.21)
SPI2_MISO: MB1-Hed-r1.0 (R317.1), MB1-MCU-r1.0 (U00.35)
SPI2_MOSI/I2S2_SD: MB1-Hed-r1.0 (R316.1), MB1-MCU-r1.0 (U00.36)
SPI2_NSS/I2S2_WS: MB1-Hed-r1.0 (R319.1), MB1-MCU-r1.0 (U00.33)
SPI2_SCK/I2S2_CK: MB1-Hed-r1.0 (R318.1), MB1-MCU-r1.0 (U00.34)
TM3_CH1: MB1-Hed-r1.0 (R320.1), MB1-MCU-r1.0 (U00.56)
TM3_CH2: MB1-Hed-r1.0 (R321.1), MB1-MCU-r1.0 (U00.57)
TM3_CH3: MB1-Hed-r1.0 (R322.1), MB1-MCU-r1.0 (U00.26)
TM3_CH4: MB1-Hed-r1.0 (R323.1), MB1-MCU-r1.0 (U00.27)
TM4_CH1: MB1-Hed-r1.0 (R327.1), MB1-MCU-r1.0 (U00.58)
TM4_CH2: MB1-Hed-r1.0 (R326.1), MB1-MCU-r1.0 (U00.59)
TxD: MB1-USB-r1.0 (I0.1 R17.1), MB1-MCU-r1.0 (U00.43)
US2_CTS/TM5_CH4: MB1-Hed-r1.0 (R37.1), MB1-MCU-r1.0 (U00.14)
US2_RTS/TM5_CH3: MB1-Hed-r1.0 (R36.1), MB1-MCU-r1.0 (U00.15)
US2_Rx/TM5_CH1: MB1-Hed-r1.0 (R34.1), MB1-MCU-r1.0 (U00.17)
US2_Tx/TM5_CH2: MB1-Hed-r1.0 (R35.1), MB1-MCU-r1.0 (U00.16)
US3_Rx/I2C2_SDA/TM2_CH4: MB1-Hed-r1.0 (R312.1), MB1-MCU-r1.0 (U00.30)
US3_Tx/I2C2_SCL/TM2_CH3: MB1-Hed-r1.0 (R313.1), MB1-MCU-r1.0 (U00.29)
uSD_CLK: MB1-MCU-r1.0 (U00.53), MB1-SD_CARD (S40.5)
uSD_CMD: MB1-MCU-r1.0 (U00.54), MB1-SD_CARD (R42.1 S40.3)
VUSB0: MB1-Pwr-r1.0 (F20.1), MB1-USB-r1.0 (5 pins)